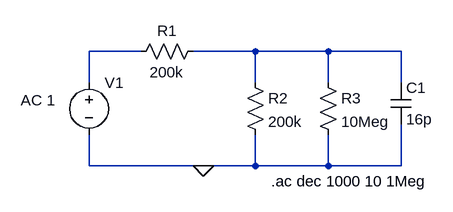
[diagram p0: schematic Exp4Part2a.asc]
Exp4Part2a.asc, the LTspice schematic file:
Version 4
SHEET 1 880 680
WIRE 48 0 -32 0
WIRE 224 0 128 0
WIRE 336 0 224 0
WIRE 448 0 336 0
WIRE -32 48 -32 0
WIRE 224 48 224 0
WIRE 336 48 336 0
WIRE 448 48 448 0
WIRE -32 176 -32 128
WIRE 144 176 -32 176
WIRE 224 176 224 128
WIRE 224 176 144 176
WIRE 336 176 336 128
WIRE 336 176 224 176
WIRE 448 176 448 112
WIRE 448 176 336 176
FLAG 144 176 0
SYMBOL res 144 -16 R90
WINDOW 0 0 56 VBottom 2
WINDOW 3 32 56 VTop 2
SYMATTR InstName R1
SYMATTR Value 200k
SYMBOL res 208 32 R0
SYMATTR InstName R2
SYMATTR Value 200k
SYMBOL voltage -32 32 R0
WINDOW 123 -105 43 Left 2
WINDOW 39 0 0 Left 0
SYMATTR InstName V1
SYMATTR Value ""
SYMATTR Value2 AC 1
SYMBOL res 320 32 R0
SYMATTR InstName R3
SYMATTR Value 10Meg
SYMBOL cap 432 48 R0
SYMATTR InstName C1
SYMATTR Value 16p
TEXT 248 200 Left 2 !.ac dec 1000 10 1Meg

The netlist it stands for:
* Exp4Part2a.asc
R1 N002 N001 200k
R2 N002 0 200k
V1 N001 0 AC 1
R3 N002 0 10Meg
C1 N002 0 16p
.ac dec 1000 10 1Meg
.backanno
.end